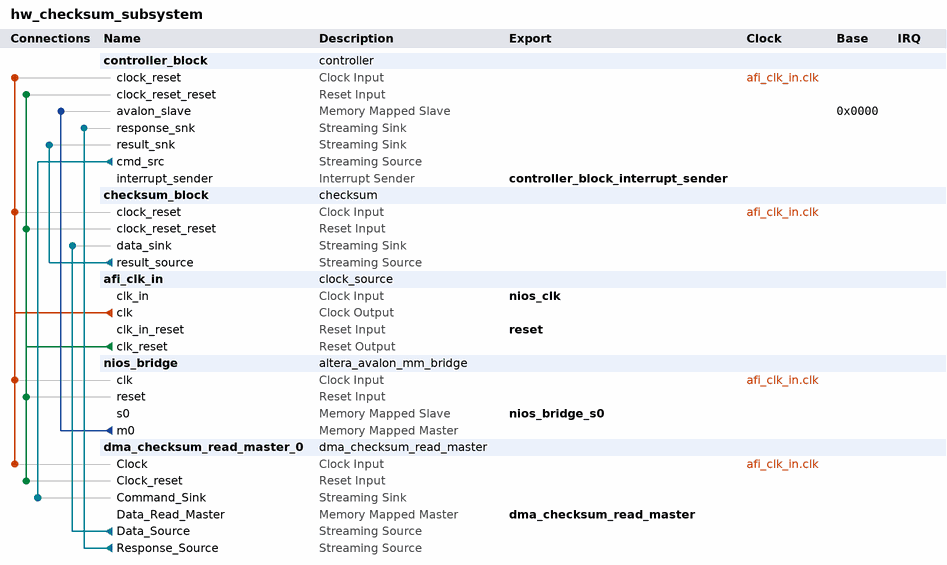
[diagram p0: system contents]
# Platform Designer (Qsys) system hw_checksum_subsystem, Arria V 5AGXFB3H4F35C4
# Parameters at their usual value, and those the tool derives, are not listed.
package require -exact qsys 18.1
create_system hw_checksum_subsystem
set_project_property DEVICE_FAMILY {Arria V}
set_project_property DEVICE 5AGXFB3H4F35C4

add_instance controller_block controller 1.0

add_instance checksum_block checksum 1.0
set_instance_parameter_value checksum_block DATA_WIDTH 32
set_instance_parameter_value checksum_block SYMBOL_WIDTH 8

add_instance afi_clk_in clock_source 18.1
set_instance_parameter_value afi_clk_in clockFrequency 100000000
set_instance_parameter_value afi_clk_in clockFrequencyKnown false

add_instance nios_bridge altera_avalon_mm_bridge 18.1
set_instance_parameter_value nios_bridge ADDRESS_UNITS SYMBOLS
set_instance_parameter_value nios_bridge ADDRESS_WIDTH 10
set_instance_parameter_value nios_bridge DATA_WIDTH 32
set_instance_parameter_value nios_bridge MAX_PENDING_RESPONSES 4
set_instance_parameter_value nios_bridge USE_AUTO_ADDRESS_WIDTH 0

add_instance dma_checksum_read_master_0 dma_checksum_read_master 1.0
set_instance_parameter_value dma_checksum_read_master_0 BURST_ENABLE 0
set_instance_parameter_value dma_checksum_read_master_0 CHANNEL_ENABLE 0
set_instance_parameter_value dma_checksum_read_master_0 CHANNEL_WIDTH 8
set_instance_parameter_value dma_checksum_read_master_0 DATA_WIDTH 32
set_instance_parameter_value dma_checksum_read_master_0 ERROR_ENABLE 0
set_instance_parameter_value dma_checksum_read_master_0 ERROR_WIDTH 8
set_instance_parameter_value dma_checksum_read_master_0 FIFO_DEPTH 32
set_instance_parameter_value dma_checksum_read_master_0 FIFO_SPEED_OPTIMIZATION 1
set_instance_parameter_value dma_checksum_read_master_0 GUI_BURST_WRAPPING_SUPPORT 1
set_instance_parameter_value dma_checksum_read_master_0 GUI_MAX_BURST_COUNT 4
set_instance_parameter_value dma_checksum_read_master_0 GUI_PROGRAMMABLE_BURST_ENABLE 0
set_instance_parameter_value dma_checksum_read_master_0 GUI_STRIDE_WIDTH 1
set_instance_parameter_value dma_checksum_read_master_0 LENGTH_WIDTH 32
set_instance_parameter_value dma_checksum_read_master_0 PACKET_ENABLE 1
set_instance_parameter_value dma_checksum_read_master_0 STRIDE_ENABLE 0
set_instance_parameter_value dma_checksum_read_master_0 TRANSFER_TYPE {Aligned Accesses}

# connections
add_connection afi_clk_in.clk checksum_block.clock_reset clock
add_connection afi_clk_in.clk controller_block.clock_reset clock
add_connection afi_clk_in.clk dma_checksum_read_master_0.Clock clock
add_connection afi_clk_in.clk nios_bridge.clk clock
add_connection afi_clk_in.clk_reset checksum_block.clock_reset_reset reset
add_connection afi_clk_in.clk_reset controller_block.clock_reset_reset reset
add_connection afi_clk_in.clk_reset dma_checksum_read_master_0.Clock_reset reset
add_connection afi_clk_in.clk_reset nios_bridge.reset reset
add_connection nios_bridge.m0 controller_block.avalon_slave avalon
set_connection_parameter_value nios_bridge.m0/controller_block.avalon_slave baseAddress 0x0000
add_connection checksum_block.result_source controller_block.result_snk avalon_streaming
add_connection controller_block.cmd_src dma_checksum_read_master_0.Command_Sink avalon_streaming
add_connection dma_checksum_read_master_0.Data_Source checksum_block.data_sink avalon_streaming
add_connection dma_checksum_read_master_0.Response_Source controller_block.response_snk avalon_streaming

# exported interfaces
add_interface controller_block_interrupt_sender interrupt sender
set_interface_property controller_block_interrupt_sender EXPORT_OF controller_block.interrupt_sender
add_interface dma_checksum_read_master avalon master
set_interface_property dma_checksum_read_master EXPORT_OF dma_checksum_read_master_0.Data_Read_Master
add_interface nios_bridge_s0 avalon slave
set_interface_property nios_bridge_s0 EXPORT_OF nios_bridge.s0
add_interface nios_clk clock sink
set_interface_property nios_clk EXPORT_OF afi_clk_in.clk_in
add_interface reset reset sink
set_interface_property reset EXPORT_OF afi_clk_in.clk_in_reset

set_interconnect_requirement {$system} qsys_mm.clockCrossingAdapter AUTO
set_interconnect_requirement {$system} qsys_mm.maxAdditionalLatency 3

save_system hw_checksum_subsystem.qsys
